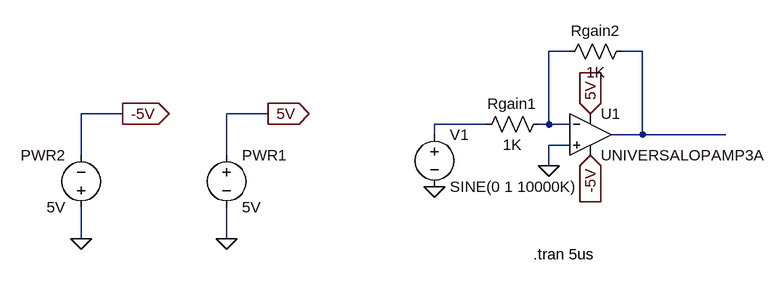
[diagram p0: schematic inverter.asc]
inverter.asc, the LTspice schematic file:
Version 4
SHEET 1 880 952
WIRE 224 240 192 240
WIRE 336 240 304 240
WIRE -464 336 -528 336
WIRE -240 336 -304 336
WIRE 96 352 16 352
WIRE 192 352 192 240
WIRE 192 352 176 352
WIRE 224 352 192 352
WIRE 16 368 16 352
WIRE 336 368 336 240
WIRE 336 368 288 368
WIRE 464 368 336 368
WIRE 224 384 192 384
WIRE -528 400 -528 336
WIRE -304 400 -304 336
WIRE 192 416 192 384
WIRE -528 528 -528 480
WIRE -304 528 -304 480
FLAG -304 528 0
FLAG -240 336 5V
IOPIN -240 336 Out
FLAG -528 528 0
FLAG -464 336 -5V
IOPIN -464 336 Out
FLAG 256 336 5V
IOPIN 256 336 In
FLAG 256 400 -5V
IOPIN 256 400 In
FLAG 16 448 0
FLAG 192 416 0
SYMBOL Voltage -304 384 R0
SYMATTR InstName PWR1
SYMATTR Value 5V
SYMBOL Voltage -528 496 R180
WINDOW 0 24 96 Left 2
WINDOW 3 24 16 Left 2
SYMATTR InstName PWR2
SYMATTR Value 5V
SYMBOL Voltage 16 352 R0
SYMATTR InstName V1
SYMATTR Value SINE(0 1 10000K)
SYMBOL Res 192 336 R90
WINDOW 0 0 56 VBottom 2
WINDOW 3 32 56 VTop 2
SYMATTR InstName Rgain1
SYMATTR Value 1K
SYMBOL Res 320 224 R90
WINDOW 0 0 56 VBottom 2
WINDOW 3 32 56 VTop 2
SYMATTR InstName Rgain2
SYMATTR Value 1K
SYMBOL OpAmps/UniversalOpAmp3a 256 368 R0
SYMATTR InstName U1
TEXT 168 552 Left 2 !.tran 5us

The netlist it stands for:
* inverter.asc
V§PWR1 5V 0 5V
V§PWR2 0 -5V 5V
V1 N003 0 SINE(0 1 10000K)
Rgain1 N001 N003 1K
Rgain2 N002 N001 1K
XU1 0 N001 5V -5V N002 level3a Avol=1Meg GBW=10Meg Slew=10Meg Ilimit=25m Rail=0 Vos=0 Phimargin=45 En=0 Enk=0 In=0 Ink=0 Rin=500Meg  ; UNIVERSALOPAMP3A, pins In+ In- V+ V- OUT
.tran 5us
.backanno
.end